# EAGLE schematic rjcar (EAGLE 5.10)
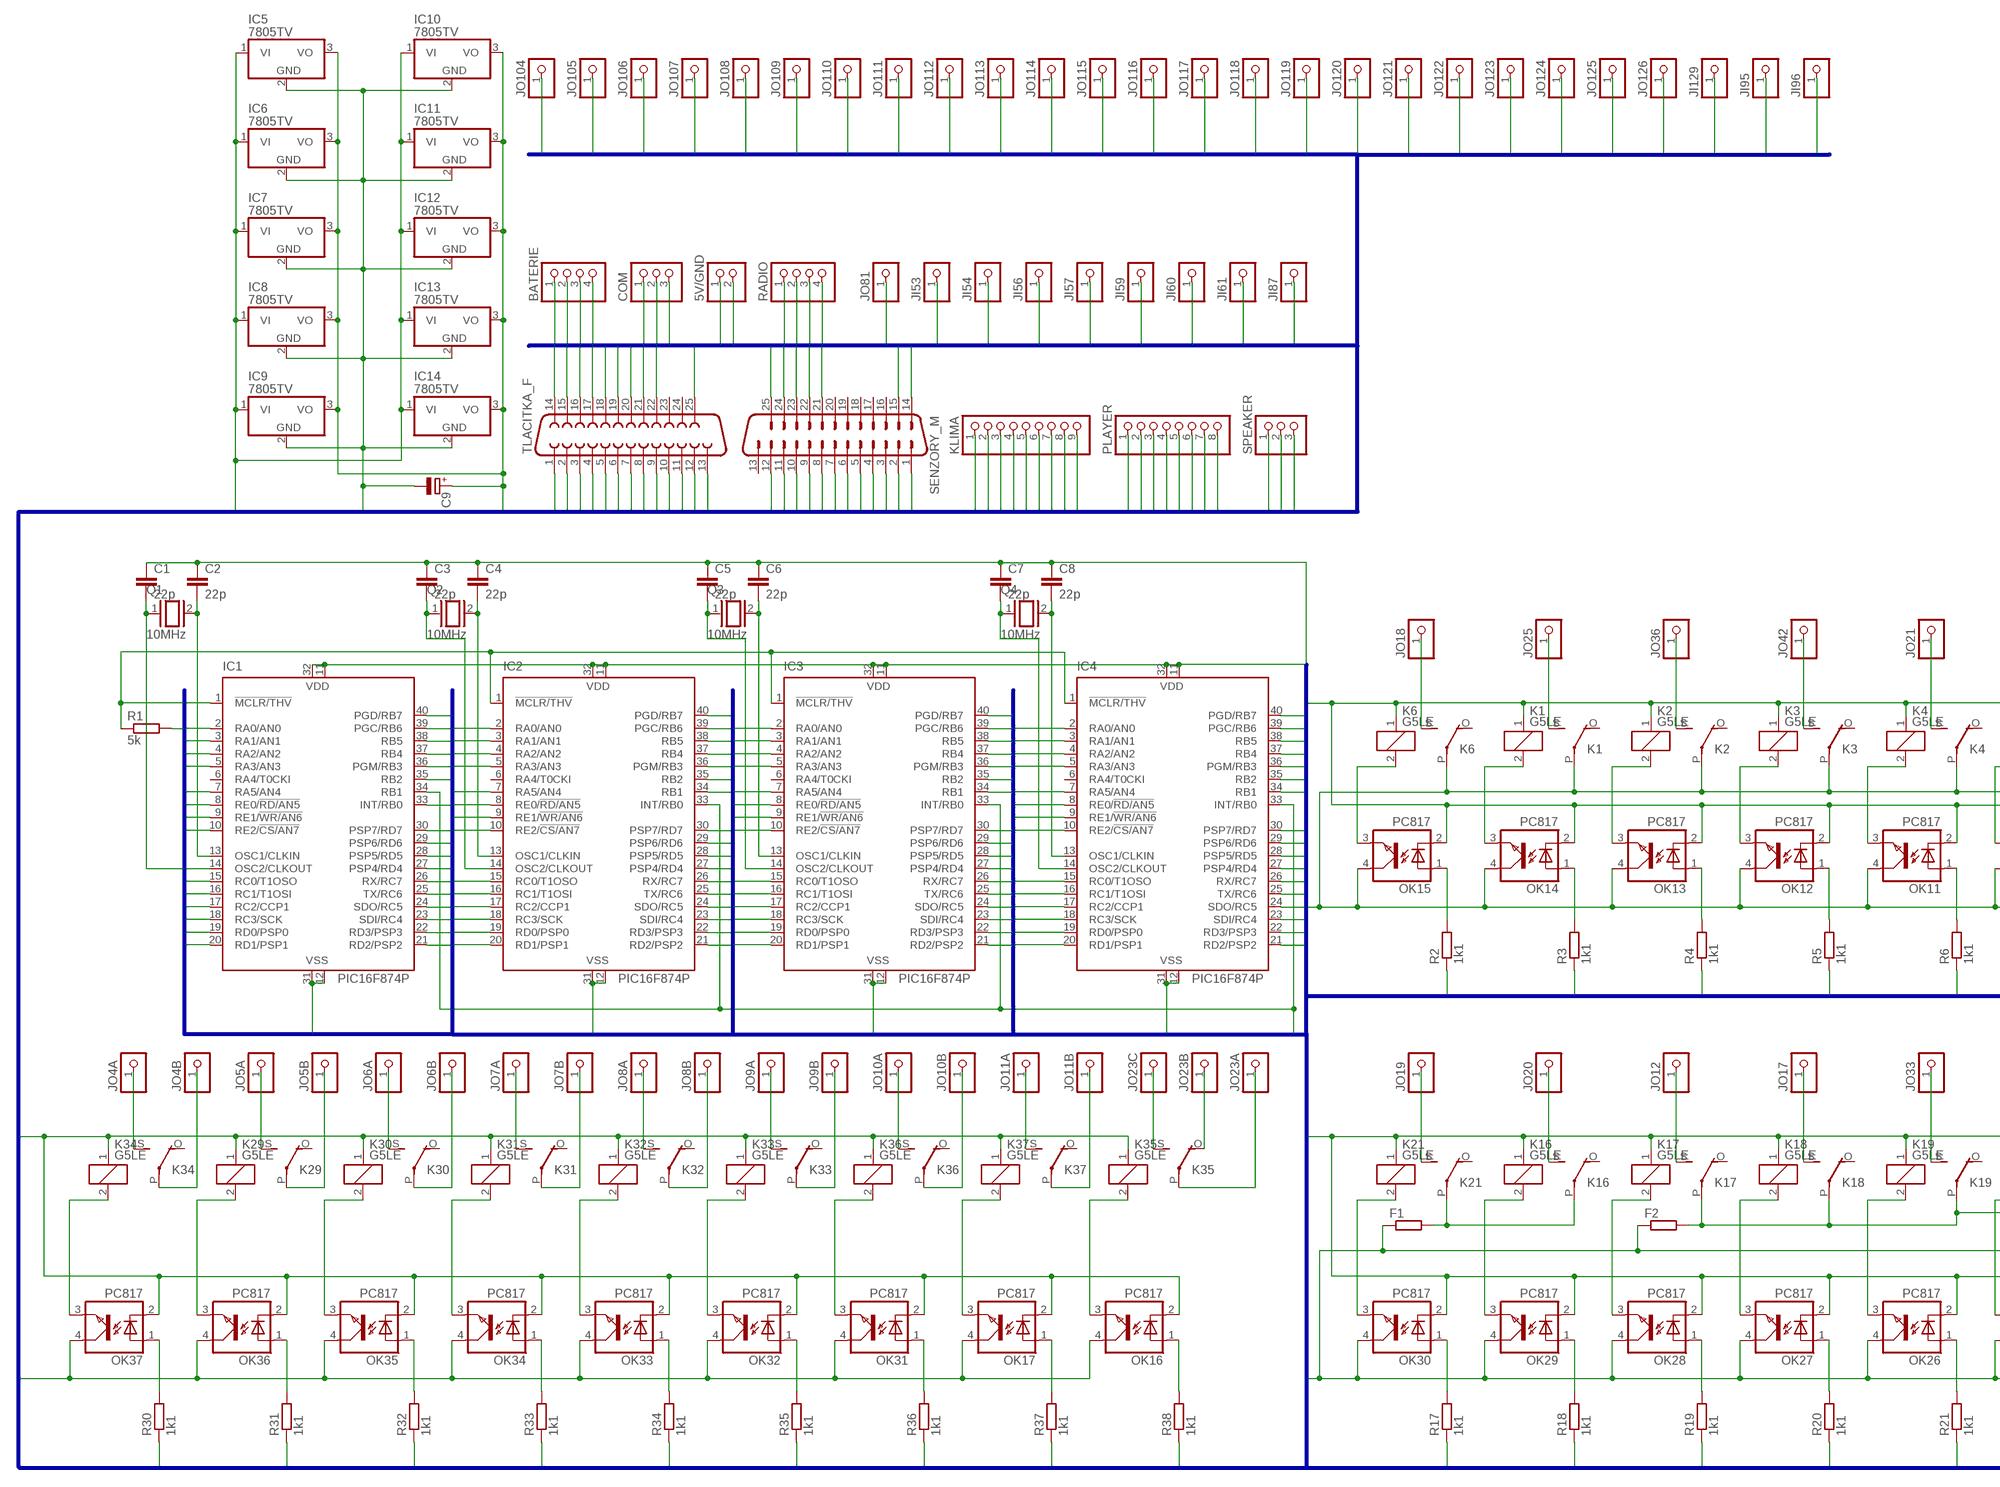
[diagram p0: schematic, sheet 1, part 1 of 2]
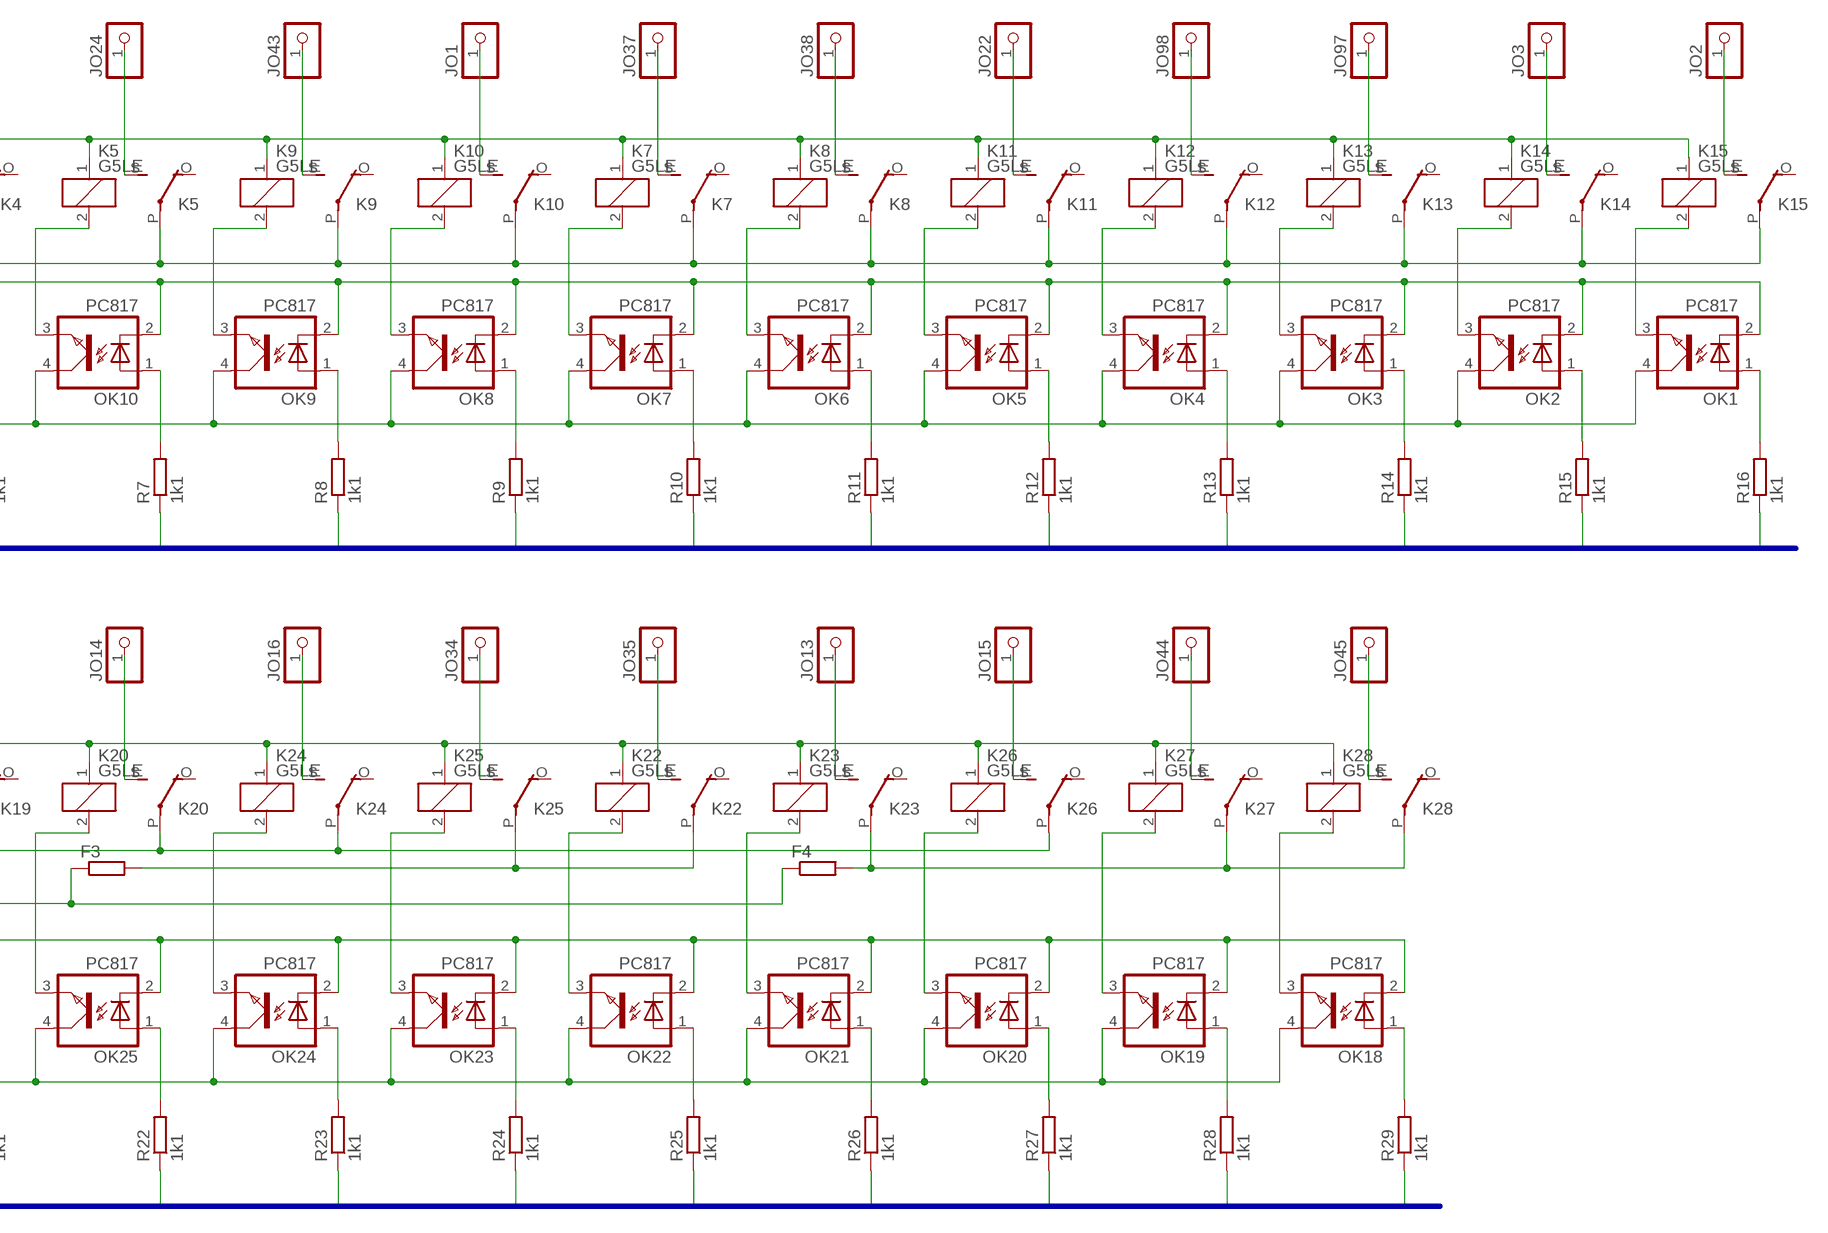
[diagram p1: schematic, sheet 1, part 2 of 2]

## Parts
5V/GND  PINHD-1X2  [1X02]
BATERIE  PINHD-1X4  [1X04]
C1  22p  C-EU025-024X044  [C025-024X044]
C2  22p  C-EU025-024X044  [C025-024X044]
C3  22p  C-EU025-024X044  [C025-024X044]
C4  22p  C-EU025-024X044  [C025-024X044]
C5  22p  C-EU025-024X044  [C025-024X044]
C6  22p  C-EU025-024X044  [C025-024X044]
C7  22p  C-EU025-024X044  [C025-024X044]
C8  22p  C-EU025-024X044  [C025-024X044]
C9  CPOL-EUE3.5-8  [E3,5-8]
COM  PINHD-1X3  [1X03]
F1  R-EU_0207/10  [0207/10]
F2  R-EU_0207/10  [0207/10]
F3  R-EU_0207/10  [0207/10]
F4  R-EU_0207/10  [0207/10]
IC1  PIC16F874P  [DIL40]
IC2  PIC16F874P  [DIL40]
IC3  PIC16F874P  [DIL40]
IC4  PIC16F874P  [DIL40]
IC5  7805TV  [TO220V]
IC6  7805TV  [TO220V]
IC7  7805TV  [TO220V]
IC8  7805TV  [TO220V]
IC9  7805TV  [TO220V]
IC10  7805TV  [TO220V]
IC11  7805TV  [TO220V]
IC12  7805TV  [TO220V]
IC13  7805TV  [TO220V]
IC14  7805TV  [TO220V]
JI53  PINHD-1X1  [1X01]
JI54  PINHD-1X1  [1X01]
JI56  PINHD-1X1  [1X01]
JI57  PINHD-1X1  [1X01]
JI59  PINHD-1X1  [1X01]
JI60  PINHD-1X1  [1X01]
JI61  PINHD-1X1  [1X01]
JI87  PINHD-1X1  [1X01]
JI95  PINHD-1X1  [1X01]
JI96  PINHD-1X1  [1X01]
JI129  PINHD-1X1  [1X01]
JO1  PINHD-1X1  [1X01]
JO2  PINHD-1X1  [1X01]
JO3  PINHD-1X1  [1X01]
JO4A  PINHD-1X1  [1X01]
JO4B  PINHD-1X1  [1X01]
JO5A  PINHD-1X1  [1X01]
JO5B  PINHD-1X1  [1X01]
JO6A  PINHD-1X1  [1X01]
JO6B  PINHD-1X1  [1X01]
JO7A  PINHD-1X1  [1X01]
JO7B  PINHD-1X1  [1X01]
JO8A  PINHD-1X1  [1X01]
JO8B  PINHD-1X1  [1X01]
JO9A  PINHD-1X1  [1X01]
JO9B  PINHD-1X1  [1X01]
JO10A  PINHD-1X1  [1X01]
JO10B  PINHD-1X1  [1X01]
JO11A  PINHD-1X1  [1X01]
JO11B  PINHD-1X1  [1X01]
JO12  PINHD-1X1  [1X01]
JO13  PINHD-1X1  [1X01]
JO14  PINHD-1X1  [1X01]
JO15  PINHD-1X1  [1X01]
JO16  PINHD-1X1  [1X01]
JO17  PINHD-1X1  [1X01]
JO18  PINHD-1X1  [1X01]
JO19  PINHD-1X1  [1X01]
JO20  PINHD-1X1  [1X01]
JO21  PINHD-1X1  [1X01]
JO22  PINHD-1X1  [1X01]
JO23A  PINHD-1X1  [1X01]
JO23B  PINHD-1X1  [1X01]
JO23C  PINHD-1X1  [1X01]
JO24  PINHD-1X1  [1X01]
JO25  PINHD-1X1  [1X01]
JO33  PINHD-1X1  [1X01]
JO34  PINHD-1X1  [1X01]
JO35  PINHD-1X1  [1X01]
JO36  PINHD-1X1  [1X01]
JO37  PINHD-1X1  [1X01]
JO38  PINHD-1X1  [1X01]
JO42  PINHD-1X1  [1X01]
JO43  PINHD-1X1  [1X01]
JO44  PINHD-1X1  [1X01]
JO45  PINHD-1X1  [1X01]
JO81  PINHD-1X1  [1X01]
JO97  PINHD-1X1  [1X01]
JO98  PINHD-1X1  [1X01]
JO104  PINHD-1X1  [1X01]
JO105  PINHD-1X1  [1X01]
JO106  PINHD-1X1  [1X01]
JO107  PINHD-1X1  [1X01]
JO108  PINHD-1X1  [1X01]
JO109  PINHD-1X1  [1X01]
JO110  PINHD-1X1  [1X01]
JO111  PINHD-1X1  [1X01]
JO112  PINHD-1X1  [1X01]
JO113  PINHD-1X1  [1X01]
JO114  PINHD-1X1  [1X01]
JO115  PINHD-1X1  [1X01]
JO116  PINHD-1X1  [1X01]
JO117  PINHD-1X1  [1X01]
JO118  PINHD-1X1  [1X01]
JO119  PINHD-1X1  [1X01]
JO120  PINHD-1X1  [1X01]
JO121  PINHD-1X1  [1X01]
JO122  PINHD-1X1  [1X01]
JO123  PINHD-1X1  [1X01]
JO124  PINHD-1X1  [1X01]
JO125  PINHD-1X1  [1X01]
JO126  PINHD-1X1  [1X01]
K1  G5LE  [G5LE]
K2  G5LE  [G5LE]
K3  G5LE  [G5LE]
K4  G5LE  [G5LE]
K5  G5LE  [G5LE]
K6  G5LE  [G5LE]
K7  G5LE  [G5LE]
K8  G5LE  [G5LE]
K9  G5LE  [G5LE]
K10  G5LE  [G5LE]
K11  G5LE  [G5LE]
K12  G5LE  [G5LE]
K13  G5LE  [G5LE]
K14  G5LE  [G5LE]
K15  G5LE  [G5LE]
K16  G5LE  [G5LE]
K17  G5LE  [G5LE]
K18  G5LE  [G5LE]
K19  G5LE  [G5LE]
K20  G5LE  [G5LE]
K21  G5LE  [G5LE]
K22  G5LE  [G5LE]
K23  G5LE  [G5LE]
K24  G5LE  [G5LE]
K25  G5LE  [G5LE]
K26  G5LE  [G5LE]
K27  G5LE  [G5LE]
K28  G5LE  [G5LE]
K29  G5LE  [G5LE]
K30  G5LE  [G5LE]
K31  G5LE  [G5LE]
K32  G5LE  [G5LE]
K33  G5LE  [G5LE]
K34  G5LE  [G5LE]
K35  G5LE  [G5LE]
K36  G5LE  [G5LE]
K37  G5LE  [G5LE]
KLIMA  PINHD-1X9  [1X09]
OK1  PC817  [DIL04]
OK2  PC817  [DIL04]
OK3  PC817  [DIL04]
OK4  PC817  [DIL04]
OK5  PC817  [DIL04]
OK6  PC817  [DIL04]
OK7  PC817  [DIL04]
OK8  PC817  [DIL04]
OK9  PC817  [DIL04]
OK10  PC817  [DIL04]
OK11  PC817  [DIL04]
OK12  PC817  [DIL04]
OK13  PC817  [DIL04]
OK14  PC817  [DIL04]
OK15  PC817  [DIL04]
OK16  PC817  [DIL04]
OK17  PC817  [DIL04]
OK18  PC817  [DIL04]
OK19  PC817  [DIL04]
OK20  PC817  [DIL04]
OK21  PC817  [DIL04]
OK22  PC817  [DIL04]
OK23  PC817  [DIL04]
OK24  PC817  [DIL04]
OK25  PC817  [DIL04]
OK26  PC817  [DIL04]
OK27  PC817  [DIL04]
OK28  PC817  [DIL04]
OK29  PC817  [DIL04]
OK30  PC817  [DIL04]
OK31  PC817  [DIL04]
OK32  PC817  [DIL04]
OK33  PC817  [DIL04]
OK34  PC817  [DIL04]
OK35  PC817  [DIL04]
OK36  PC817  [DIL04]
OK37  PC817  [DIL04]
PLAYER  PINHD-1X8  [1X08]
Q1  10MHz  XTAL/S  [QS]
Q2  10MHz  XTAL/S  [QS]
Q3  10MHz  XTAL/S  [QS]
Q4  10MHz  XTAL/S  [QS]
R1  5k  R-EU_0207/7  [0207/7]
R2  1k1  R-EU_0207/7  [0207/7]
R3  1k1  R-EU_0207/7  [0207/7]
R4  1k1  R-EU_0207/7  [0207/7]
R5  1k1  R-EU_0207/7  [0207/7]
R6  1k1  R-EU_0207/7  [0207/7]
R7  1k1  R-EU_0207/7  [0207/7]
R8  1k1  R-EU_0207/7  [0207/7]
R9  1k1  R-EU_0207/7  [0207/7]
R10  1k1  R-EU_0207/7  [0207/7]
R11  1k1  R-EU_0207/7  [0207/7]
R12  1k1  R-EU_0207/7  [0207/7]
R13  1k1  R-EU_0207/7  [0207/7]
R14  1k1  R-EU_0207/7  [0207/7]
R15  1k1  R-EU_0207/7  [0207/7]
R16  1k1  R-EU_0207/7  [0207/7]
R17  1k1  R-EU_0207/7  [0207/7]
R18  1k1  R-EU_0207/7  [0207/7]
R19  1k1  R-EU_0207/7  [0207/7]
R20  1k1  R-EU_0207/7  [0207/7]
R21  1k1  R-EU_0207/7  [0207/7]
R22  1k1  R-EU_0207/7  [0207/7]
R23  1k1  R-EU_0207/7  [0207/7]
R24  1k1  R-EU_0207/7  [0207/7]
R25  1k1  R-EU_0207/7  [0207/7]
R26  1k1  R-EU_0207/7  [0207/7]
R27  1k1  R-EU_0207/7  [0207/7]
R28  1k1  R-EU_0207/7  [0207/7]
R29  1k1  R-EU_0207/7  [0207/7]
R30  1k1  R-EU_0207/7  [0207/7]
R31  1k1  R-EU_0207/7  [0207/7]
R32  1k1  R-EU_0207/7  [0207/7]
R33  1k1  R-EU_0207/7  [0207/7]
R34  1k1  R-EU_0207/7  [0207/7]
R35  1k1  R-EU_0207/7  [0207/7]
R36  1k1  R-EU_0207/7  [0207/7]
R37  1k1  R-EU_0207/7  [0207/7]
R38  1k1  R-EU_0207/7  [0207/7]
RADIO  PINHD-1X4  [1X04]
SENZORY_M  M25HP  [M25HP]
SPEAKER  PINHD-1X3  [1X03]
TLACITKA_F  F25HP  [F25HP]

## Nets
BKUFR1: SENZORY_M.14 TLACITKA_F.21
BKUFR2: SENZORY_M.15 TLACITKA_F.22
COM: COM.2 IC1.34(RB1) IC2.33(INT/RB0) IC3.33(INT/RB0) IC4.33(INT/RB0)
I49: IC2.10(RE2/!CS/AN7) KLIMA.6
I50: IC1.4(RA2/AN2) SENZORY_M.12
I51: BATERIE.3 IC2.2(RA0/AN0)
I52: IC2.3(RA1/AN1) KLIMA.7
I53: IC2.4(RA2/AN2) JI53.1
I54: IC2.5(RA3/AN3) JI54.1
I55: IC2.7(RA5/AN4) SENZORY_M.2
I56: IC2.8(RE0/!RD/AN5) JI56.1
I57: IC2.9(RE1/!WR/AN6) JI57.1
I58: IC1.2(RA0/AN0) TLACITKA_F.2
I59: IC1.5(RA3/AN3) JI59.1
I60: IC1.7(RA5/AN4) JI60.1
I61: IC1.8(RE0/!RD/AN5) JI61.1
I62: IC1.3(RA1/AN1) TLACITKA_F.3
I80: IC3.2(RA0/AN0) SENZORY_M.11
I84: IC3.3(RA1/AN1) SENZORY_M.4
I85: IC3.4(RA2/AN2) SENZORY_M.6
I86: IC3.5(RA3/AN3) SENZORY_M.8
I87: IC3.7(RA5/AN4) JI87.1
I88: IC3.8(RE0/!RD/AN5) SENZORY_M.9
I89: IC3.9(RE1/!WR/AN6) SENZORY_M.10
I90: IC3.10(RE2/!CS/AN7) SENZORY_M.1
I91: IC4.2(RA0/AN0) SENZORY_M.3
I92: IC4.3(RA1/AN1) SENZORY_M.5
I93: IC4.4(RA2/AN2) SENZORY_M.7
I95: IC4.9(RE1/!WR/AN6) JI95.1
I96: IC4.10(RE2/!CS/AN7) JI96.1
I127: IC4.5(RA3/AN3) KLIMA.8
I128: IC4.7(RA5/AN4) TLACITKA_F.4
I129: IC4.8(RE0/!RD/AN5) JI129.1
MCLR: IC1.1(!MCLR/THV) IC2.1(!MCLR/THV) IC3.1(!MCLR/THV) IC4.1(!MCLR/THV) R1.1
N$1: C7.2 IC4.14(OSC2/CLKOUT) Q4.1
N$2: K6.2 OK15.3(EMIT)
N$3: C2.2 IC1.13(OSC1/CLKIN) Q1.2
N$4: C3.2 IC2.14(OSC2/CLKOUT) Q2.1
N$5: C4.2 IC2.13(OSC1/CLKIN) Q2.2
N$6: K1.2 OK14.3(EMIT)
N$7: C5.2 IC3.14(OSC2/CLKOUT) Q3.1
N$8: C6.2 IC3.13(OSC1/CLKIN) Q3.2
N$9: K2.2 OK13.3(EMIT)
N$10: C8.2 IC4.13(OSC1/CLKIN) Q4.2
N$11: K3.2 OK12.3(EMIT)
N$12: K4.2 OK11.3(EMIT)
N$13: C1.2 IC1.14(OSC2/CLKOUT) Q1.1
N$14: K5.2 OK10.3(EMIT)
N$15: K9.2 OK9.3(EMIT)
N$16: K10.2 OK8.3(EMIT)
N$17: K7.2 OK7.3(EMIT)
N$18: K8.2 OK6.3(EMIT)
N$19: K11.2 OK5.3(EMIT)
N$20: K12.2 OK4.3(EMIT)
N$21: K13.2 OK3.3(EMIT)
N$22: K14.2 OK2.3(EMIT)
N$23: K15.2 OK1.3(EMIT)
N$24: JO18.1 K6.S(2:S)
N$25: OK15.1(A) R2.2
N$26: OK14.1(A) R3.2
N$27: OK13.1(A) R4.2
N$28: OK12.1(A) R5.2
N$29: OK11.1(A) R6.2
N$30: OK10.1(A) R7.2
N$31: OK9.1(A) R8.2
N$32: OK8.1(A) R9.2
N$33: OK7.1(A) R10.2
N$34: OK6.1(A) R11.2
N$35: OK5.1(A) R12.2
N$36: OK4.1(A) R13.2
N$37: OK3.1(A) R14.2
N$38: OK2.1(A) R15.2
N$39: OK1.1(A) R16.2
N$40: JO25.1 K1.S(2:S)
N$41: JO36.1 K2.S(2:S)
N$42: JO42.1 K3.S(2:S)
N$43: JO21.1 K4.S(2:S)
N$44: JO24.1 K5.S(2:S)
N$45: JO43.1 K9.S(2:S)
N$46: JO1.1 K10.S(2:S)
N$47: JO37.1 K7.S(2:S)
N$48: JO38.1 K8.S(2:S)
N$49: JO22.1 K11.S(2:S)
N$50: JO98.1 K12.S(2:S)
N$51: JO97.1 K13.S(2:S)
N$52: JO3.1 K14.S(2:S)
N$53: JO2.1 K15.S(2:S)
N$54: K21.2 OK30.3(EMIT)
N$55: K16.2 OK29.3(EMIT)
N$56: K17.2 OK28.3(EMIT)
N$57: K18.2 OK27.3(EMIT)
N$58: K19.2 OK26.3(EMIT)
N$59: K20.2 OK25.3(EMIT)
N$60: K24.2 OK24.3(EMIT)
N$61: K25.2 OK23.3(EMIT)
N$62: K22.2 OK22.3(EMIT)
N$63: K23.2 OK21.3(EMIT)
N$64: K26.2 OK20.3(EMIT)
N$65: K27.2 OK19.3(EMIT)
N$66: K28.2 OK18.3(EMIT)
N$67: F3.2 K22.P(2:P) K25.P(2:P)
N$68: F1.2 K16.P(2:P) K21.P(2:P)
N$69: OK30.1(A) R17.2
N$70: OK29.1(A) R18.2
N$71: OK28.1(A) R19.2
N$72: OK27.1(A) R20.2
N$73: OK26.1(A) R21.2
N$74: OK25.1(A) R22.2
N$75: OK24.1(A) R23.2
N$76: OK23.1(A) R24.2
N$77: OK22.1(A) R25.2
N$78: OK21.1(A) R26.2
N$79: OK20.1(A) R27.2
N$80: OK19.1(A) R28.2
N$81: OK18.1(A) R29.2
N$83: F4.2 K23.P(2:P) K27.P(2:P) K28.P(2:P)
N$84: JO19.1 K21.S(2:S)
N$85: JO12.1 K17.S(2:S)
N$86: JO17.1 K18.S(2:S)
N$87: JO14.1 K20.S(2:S)
N$88: JO33.1 K19.S(2:S)
N$89: JO16.1 K24.S(2:S)
N$90: JO34.1 K25.S(2:S)
N$91: JO35.1 K22.S(2:S)
N$92: JO13.1 K23.S(2:S)
N$93: JO20.1 K16.S(2:S)
N$94: JO15.1 K26.S(2:S)
N$95: JO44.1 K27.S(2:S)
N$96: JO45.1 K28.S(2:S)
N$97: K34.2 OK37.3(EMIT)
N$98: K29.2 OK36.3(EMIT)
N$99: K30.2 OK35.3(EMIT)
N$100: K31.2 OK34.3(EMIT)
N$101: K32.2 OK33.3(EMIT)
N$102: K33.2 OK32.3(EMIT)
N$103: K36.2 OK31.3(EMIT)
N$104: K37.2 OK17.3(EMIT)
N$105: K35.2 OK16.3(EMIT)
N$106: OK37.1(A) R30.2
N$107: OK36.1(A) R31.2
N$108: OK35.1(A) R32.2
N$109: OK34.1(A) R33.2
N$110: OK33.1(A) R34.2
N$111: OK32.1(A) R35.2
N$112: OK31.1(A) R36.2
N$113: OK17.1(A) R37.2
N$114: OK16.1(A) R38.2
N$115: JO4A.1 K34.S(2:S)
N$116: JO6A.1 K30.S(2:S)
N$117: JO7A.1 K31.S(2:S)
N$118: JO9A.1 K33.S(2:S)
N$119: JO8A.1 K32.S(2:S)
N$120: JO10A.1 K36.S(2:S)
N$121: JO11A.1 K37.S(2:S)
N$122: JO23C.1 K35.S(2:S)
N$123: JO5A.1 K29.S(2:S)
N$124: JO4B.1 K34.P(2:P)
N$125: JO5B.1 K29.P(2:P)
N$126: JO6B.1 K30.P(2:P)
N$127: JO7B.1 K31.P(2:P)
N$128: JO8B.1 K32.P(2:P)
N$129: JO9B.1 K33.P(2:P)
N$130: JO10B.1 K36.P(2:P)
N$131: JO11B.1 K37.P(2:P)
N$132: JO23A.1 K35.P(2:P)
N$133: JO23B.1 K35.O(2:O)
N$134: F2.2 K17.P(2:P) K18.P(2:P) K19.P(2:P) K20.P(2:P) K24.P(2:P) K26.P(2:P)
O1: IC1.15(RC0/T1OSO) R9.1
O2: IC1.16(RC1/T1OSI) R16.1
O3: IC1.17(RC2/CCP1) R15.1
O4: IC3.28(PSP5/RD5) R30.1
O5: IC2.19(RD0/PSP0) R31.1
O6: IC2.35(RB2) R32.1
O7: IC2.36(PGM/RB3) R33.1
O8: IC2.37(RB4) R34.1
O9: IC2.38(RB5) R35.1
O10: IC2.39(PGC/RB6) R36.1
O11: IC2.40(PGD/RB7) R37.1
O12: IC1.37(RB4) R19.1
O13: IC3.30(PSP7/RD7) R26.1
O14: IC1.26(RX/RC7) R22.1
O15: IC1.35(RB2) R27.1
O16: IC1.36(PGM/RB3) R23.1
O17: IC1.39(PGC/RB6) R20.1
O18: IC1.18(RC3/SCK) R2.1
O19: IC2.25(TX/RC6) R17.1
O20: IC2.26(RX/RC7) R18.1
O21: IC3.20(RD1/PSP1) R6.1
O22: IC1.20(RD1/PSP1) R12.1
O23: IC1.21(RD2/PSP2) R38.1
O24: IC1.22(RD3/PSP3) R7.1
O25: IC1.27(PSP4/RD4) R3.1
O26: IC2.15(RC0/T1OSO) PLAYER.2
O27: IC2.16(RC1/T1OSI) PLAYER.3
O28: IC2.17(RC2/CCP1) PLAYER.4
O29: IC2.18(RC3/SCK) PLAYER.5
O30: IC2.23(SDI/RC4) PLAYER.6
O31: IC2.24(SDO/RC5) PLAYER.7
O32: IC1.40(PGD/RB7) SENZORY_M.24
O33: IC1.38(RB5) R21.1
O34: IC3.19(RD0/PSP0) R24.1
O35: IC2.20(RD1/PSP1) R25.1
O36: IC1.28(PSP5/RD5) R4.1
O37: IC1.29(PSP6/RD6) R10.1
O38: IC1.30(PSP7/RD7) R11.1
O39: IC2.27(PSP4/RD4) KLIMA.2
O40: IC2.29(PSP6/RD6) KLIMA.3
O41: IC2.30(PSP7/RD7) KLIMA.4
O42: IC1.23(SDI/RC4) R5.1
O43: IC1.24(SDO/RC5) R8.1
O44: IC2.21(RD2/PSP2) R28.1
O45: IC2.22(RD3/PSP3) R29.1
O46: IC2.28(PSP5/RD5) KLIMA.5
O47: IC1.10(RE2/!CS/AN7) SPEAKER.2
O48: IC1.9(RE1/!WR/AN6) SENZORY_M.23
O68: IC3.29(PSP6/RD6) TLACITKA_F.5
O69: IC3.26(RX/RC7) TLACITKA_F.6
O70: IC3.35(RB2) TLACITKA_F.7
O71: IC3.36(PGM/RB3) TLACITKA_F.8
O72: IC3.37(RB4) TLACITKA_F.9
O73: IC3.38(RB5) TLACITKA_F.10
O74: IC3.39(PGC/RB6) TLACITKA_F.11
O75: IC3.40(PGD/RB7) TLACITKA_F.12
O76: IC3.15(RC0/T1OSO) TLACITKA_F.13
O77: IC3.16(RC1/T1OSI) TLACITKA_F.14
O78: IC3.17(RC2/CCP1) TLACITKA_F.15
O79: IC3.18(RC3/SCK) TLACITKA_F.16
O81: IC3.23(SDI/RC4) JO81.1
O82: IC3.24(SDO/RC5) SENZORY_M.22
O83: IC3.25(TX/RC6) SENZORY_M.21
O97: IC3.21(RD2/PSP2) R14.1
O98: IC3.22(RD3/PSP3) R13.1
O99: IC3.27(PSP4/RD4) TLACITKA_F.20
O104: IC4.30(PSP7/RD7) JO104.1
O105: IC4.34(RB1) JO105.1
O106: IC4.35(RB2) JO106.1
O107: IC4.36(PGM/RB3) JO107.1
O108: IC4.37(RB4) JO108.1
O109: IC4.38(RB5) JO109.1
O110: IC4.39(PGC/RB6) JO110.1
O111: IC4.40(PGD/RB7) JO111.1
O112: IC4.15(RC0/T1OSO) JO112.1
O113: IC4.16(RC1/T1OSI) JO113.1
O114: IC4.17(RC2/CCP1) JO114.1
O115: IC4.18(RC3/SCK) JO115.1
O116: IC4.23(SDI/RC4) JO116.1
O117: IC4.24(SDO/RC5) JO117.1
O118: IC4.25(TX/RC6) JO118.1
O119: IC4.26(RX/RC7) JO119.1
O120: IC4.19(RD0/PSP0) JO120.1
O121: IC4.20(RD1/PSP1) JO121.1
O122: IC4.21(RD2/PSP2) JO122.1
O123: IC4.22(RD3/PSP3) JO123.1
O124: IC4.27(PSP4/RD4) JO124.1
O125: IC4.28(PSP5/RD5) JO125.1
O126: IC4.29(PSP6/RD6) JO126.1
O130: IC1.19(RD0/PSP0) TLACITKA_F.17
O131: IC2.34(RB1) TLACITKA_F.18
O132: IC3.34(RB1) TLACITKA_F.19
RX: IC1.33(INT/RB0) RADIO.2
TX: IC1.25(TX/RC6) RADIO.3
V12: BATERIE.2 F1.1 F2.1 F3.1 F4.1 IC5.1(VI) IC6.1(VI) IC7.1(VI) IC8.1(VI) IC9.1(VI) IC10.1(VI) IC11.1(VI) IC12.1(VI) IC13.1(VI) IC14.1(VI) K1.P(2:P) K2.P(2:P) K3.P(2:P) K4.P(2:P) K5.P(2:P) K6.P(2:P) K7.P(2:P) K8.P(2:P) K9.P(2:P) K10.P(2:P) K11.P(2:P) K12.P(2:P) K13.P(2:P) K14.P(2:P) K15.P(2:P) OK1.4(COL) OK2.4(COL) OK3.4(COL) OK4.4(COL) OK5.4(COL) OK6.4(COL) OK7.4(COL) OK8.4(COL) OK9.4(COL) OK10.4(COL) OK11.4(COL) OK12.4(COL) OK13.4(COL) OK14.4(COL) OK15.4(COL) OK16.4(COL) OK17.4(COL) OK18.4(COL) OK19.4(COL) OK20.4(COL) OK21.4(COL) OK22.4(COL) OK23.4(COL) OK24.4(COL) OK25.4(COL) OK26.4(COL) OK27.4(COL) OK28.4(COL) OK29.4(COL) OK30.4(COL) OK31.4(COL) OK32.4(COL) OK33.4(COL) OK34.4(COL) OK35.4(COL) OK36.4(COL) OK37.4(COL)
VDD: 5V/GND.1 BATERIE.1 C9.+ COM.1 IC1.11(VDD) IC1.32(VDD) IC2.11(VDD) IC2.32(VDD) IC3.11(VDD) IC3.32(VDD) IC4.11(VDD) IC4.32(VDD) IC5.3(VO) IC6.3(VO) IC7.3(VO) IC8.3(VO) IC9.3(VO) IC10.3(VO) IC11.3(VO) IC12.3(VO) IC13.3(VO) IC14.3(VO) KLIMA.1 PLAYER.1 R1.2 RADIO.1 SENZORY_M.25 SPEAKER.1 TLACITKA_F.1
VSS: 5V/GND.2 BATERIE.4 C1.1 C2.1 C3.1 C4.1 C5.1 C6.1 C7.1 C8.1 C9.- COM.3 IC1.12(VSS) IC1.31(VSS) IC2.12(VSS) IC2.31(VSS) IC3.12(VSS) IC3.31(VSS) IC4.12(VSS) IC4.31(VSS) IC5.2(GND) IC6.2(GND) IC7.2(GND) IC8.2(GND) IC9.2(GND) IC10.2(GND) IC11.2(GND) IC12.2(GND) IC13.2(GND) IC14.2(GND) K1.1 K2.1 K3.1 K4.1 K5.1 K6.1 K7.1 K8.1 K9.1 K10.1 K11.1 K12.1 K13.1 K14.1 K15.1 K16.1 K17.1 K18.1 K19.1 K20.1 K21.1 K22.1 K23.1 K24.1 K25.1 K26.1 K27.1 K28.1 K29.1 K30.1 K31.1 K32.1 K33.1 K34.1 K35.1 K36.1 K37.1 KLIMA.9 OK1.2(C) OK2.2(C) OK3.2(C) OK4.2(C) OK5.2(C) OK6.2(C) OK7.2(C) OK8.2(C) OK9.2(C) OK10.2(C) OK11.2(C) OK12.2(C) OK13.2(C) OK14.2(C) OK15.2(C) OK16.2(C) OK17.2(C) OK18.2(C) OK19.2(C) OK20.2(C) OK21.2(C) OK22.2(C) OK23.2(C) OK24.2(C) OK25.2(C) OK26.2(C) OK27.2(C) OK28.2(C) OK29.2(C) OK30.2(C) OK31.2(C) OK32.2(C) OK33.2(C) OK34.2(C) OK35.2(C) OK36.2(C) OK37.2(C) PLAYER.8 RADIO.4 SPEAKER.3 TLACITKA_F.25
Unconnected: IC1.6(RA4/T0CKI) IC2.6(RA4/T0CKI) IC3.6(RA4/T0CKI) IC4.6(RA4/T0CKI) K1.O(2:O) K2.O(2:O) K3.O(2:O) K4.O(2:O) K5.O(2:O) K6.O(2:O) K7.O(2:O) K8.O(2:O) K9.O(2:O) K10.O(2:O) K11.O(2:O) K12.O(2:O) K13.O(2:O) K14.O(2:O) K15.O(2:O) K16.O(2:O) K17.O(2:O) K18.O(2:O) K19.O(2:O) K20.O(2:O) K21.O(2:O) K22.O(2:O) K23.O(2:O) K24.O(2:O) K25.O(2:O) K26.O(2:O) K27.O(2:O) K28.O(2:O) K29.O(2:O) K30.O(2:O) K31.O(2:O) K32.O(2:O) K33.O(2:O) K34.O(2:O) K36.O(2:O) K37.O(2:O) SENZORY_M.13 SENZORY_M.16 SENZORY_M.17 SENZORY_M.18 SENZORY_M.19 SENZORY_M.20 TLACITKA_F.23 TLACITKA_F.24

## Buses
B$1

## Library data of the parts
5V/GND = pinhead:PINHD-1X2: PIN HEADER
BATERIE RADIO = pinhead:PINHD-1X4: PIN HEADER
C1-C8 = resistor:C-EU: CAPACITOR, European symbol
C9 = resistor:CPOL-EU: POLARIZED CAPACITOR, European symbol
COM SPEAKER = pinhead:PINHD-1X3: PIN HEADER
F1-F4 R1-R38 = resistor:R-EU_: RESISTOR, European symbol
IC1-IC4 = microchip:PIC16F87*: MICROCONTROLLER
IC5-IC14 = linear:78*: Positive VOLTAGE REGULATOR Source: http://cache.national.com/ds/LM/LM78L05.pdf http://www.fairchildsemi.com/ds/LM/LM7805.pdf
JI53 JI54 JI56 JI57 JI59-JI61 JI87 JI95 JI96 JI129 JO1-JO3 JO4A JO4B JO5A JO5B JO6A JO6B JO7A JO7B JO8A JO8B JO9A JO9B JO10A JO10B JO11A JO11B JO12-JO22 JO23A JO23B JO23C JO24 JO25 JO33-JO38 JO42-JO45 JO81 JO97 JO98 JO104-JO126 = pinhead:PINHD-1X1: PIN HEADER
K1-K37 = relay:G5LE: RELAY 1 x switch, 10 A/120 V AC, 8 A/30 V DC, Omron
KLIMA = pinhead:PINHD-1X9: PIN HEADER
OK1-OK37 = optocoupler:PC817: SHARP OPTO COUPLER
PLAYER = pinhead:PINHD-1X8: PIN HEADER
Q1-Q4 = special:XTAL/S: CRYSTAL
SENZORY_M = con-subd:M25: SUB-D
TLACITKA_F = con-subd:F25: SUB-D